# Altium schematic sheet user.SchDoc
size 381 x 215 mm; PageSetup: Record=PageOptions|CenterHorizontal=True|CenterVertical=True|PrintScale=0.77|XCorrection=1.00|YCorrection=1.00|PrintKind=0|BorderSize=5000000|LeftOffset=0|BottomOffset=0|Orientation=2|PaperLength=1000|PaperWidth=1000|Scale=100|PaperSource=7|PrintQuality=-3|MediaType=1|DitherType=10|PrintScaleMode=1|PaperKind=A4|PaperIndex=9
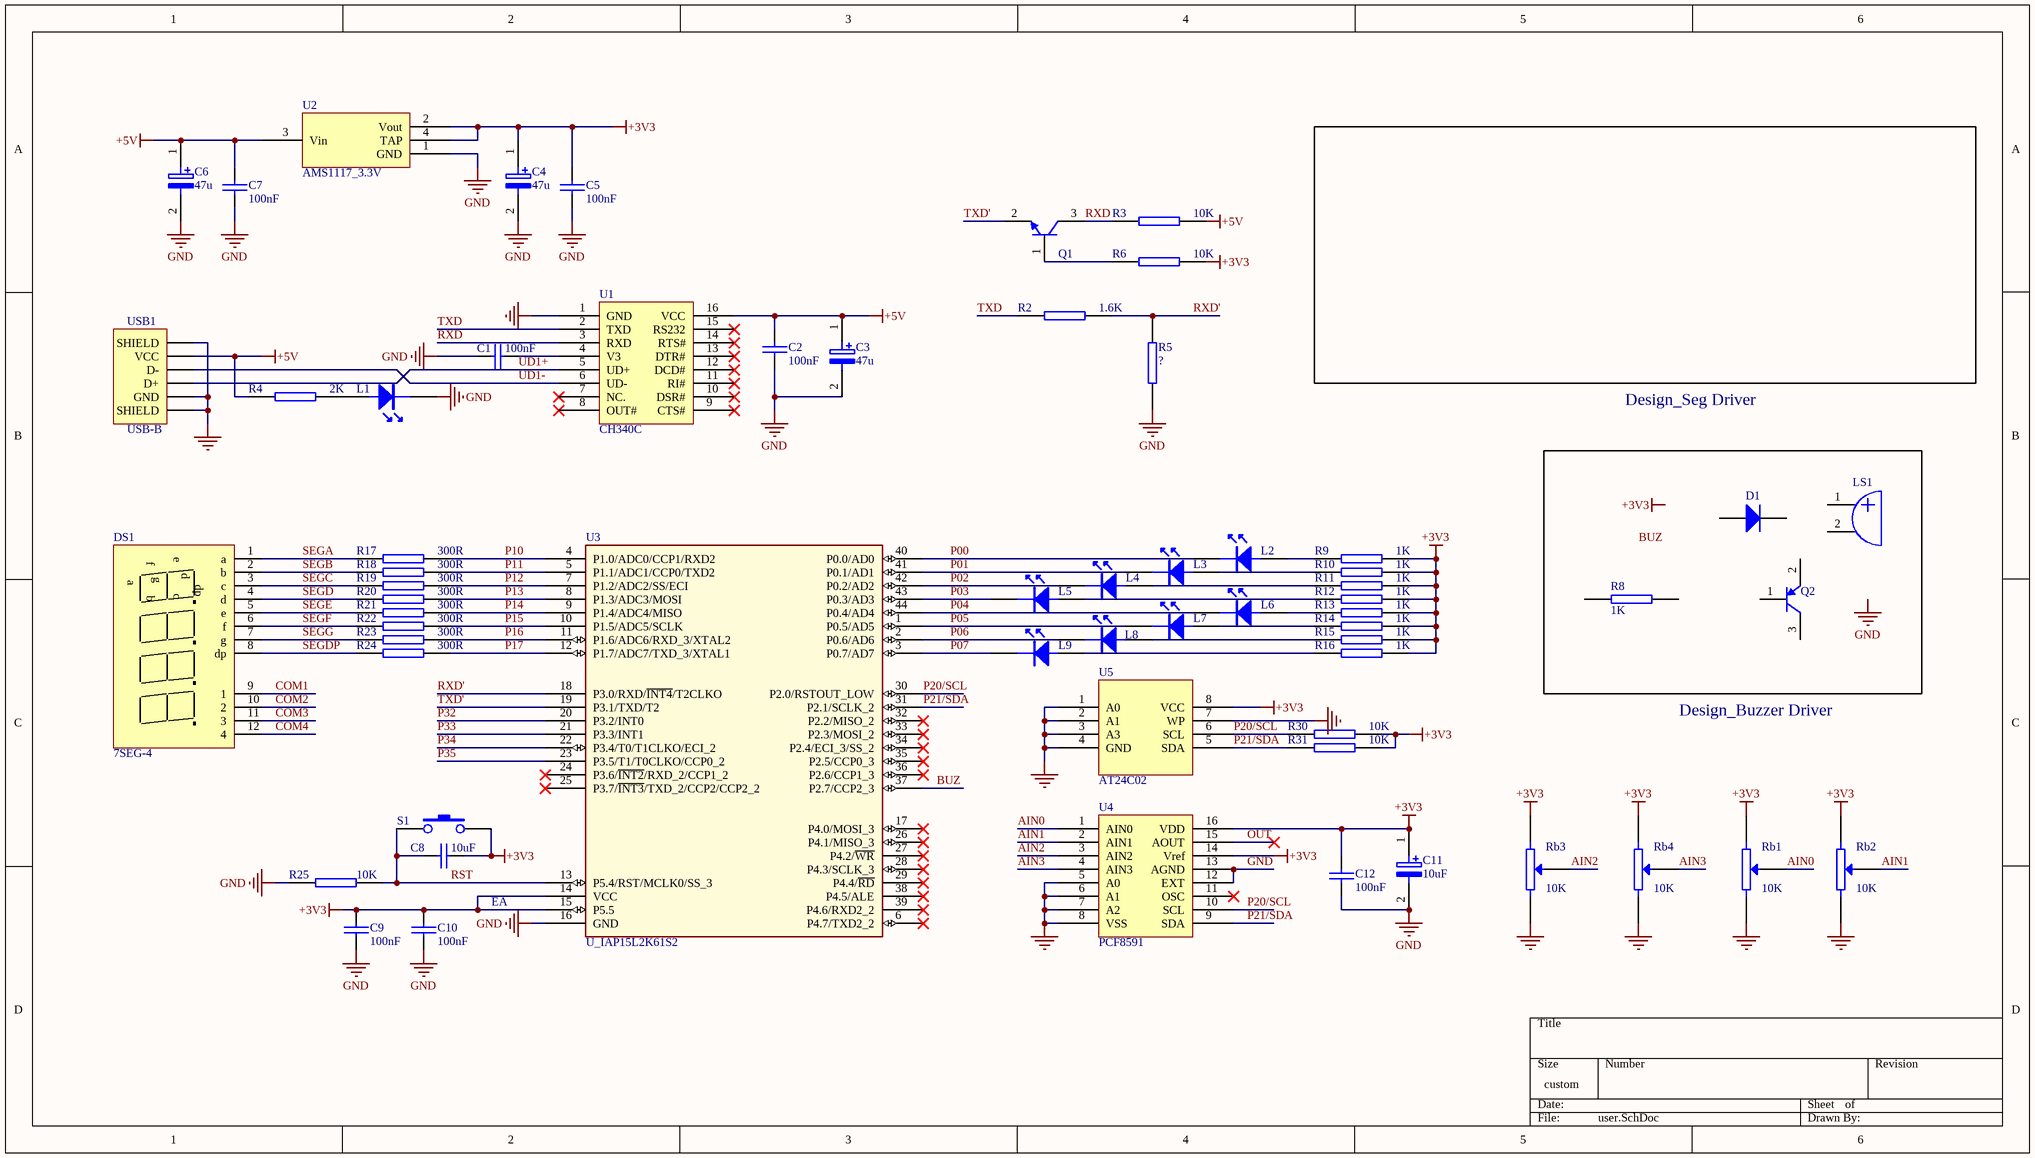
[diagram p0: user.SchDoc]

## Parts
C1  100nF
C2  100nF
C3  47u
C4  47u
C5  100nF
C6  47u
C7  100nF
C8  10uF
C9  100nF
C10  100nF
C11  10uF
C12  100nF
D1  (no value)
DS1  7SEG-4
L1  LED  (value not drawn)
L2  LED  (value not drawn)
L3  LED  (value not drawn)
L4  LED  (value not drawn)
L5  LED  (value not drawn)
L6  LED  (value not drawn)
L7  LED  (value not drawn)
L8  LED  (value not drawn)
L9  LED  (value not drawn)
LS1  S_BUZZER  (value not drawn)
Q1  8050-SOT23  (value not drawn)
Q2  (no value)
R2  1.6K
R3  10K
R4  2K
R5  ?
R6  10K
R8  1K
R9  1K
R10  1K
R11  1K
R12  1K
R13  1K
R14  1K
R15  1K
R16  1K
R17  300R
R18  300R
R19  300R
R20  300R
R21  300R
R22  300R
R23  300R
R24  300R
R25  10K
R30  10K
R31  10K
Rb1  10K
Rb2  10K
Rb3  10K
Rb4  10K
S1  SW-PB  (value not drawn)
U1  CH340C
U2  AMS1117_3.3V
U3  U_IAP15L2K61S2
U4  PCF8591
U5  AT24C02
USB1  USB-B

## Nets
+3V3: C4.1 C5.2 C8.2 C9.1 C10.1 C11.1 C12.2 R6.1 R9.2 R10.2 R11.2 R12.2 R13.2 R14.2 R15.2 R16.2 R30.1 R31.1 Rb1.1 Rb2.1 Rb3.1 Rb4.1 S1.2 U2.2(Vout) U2.4(TAP) U3.14(VCC) U3.15(P5.5) U4.14(Vref) U4.16(VDD) U5.8(VCC)
+5V: C2.1 C3.1 C6.1 C7.2 R3.1 R4.2 U1.16(VCC) U2.3(Vin) USB1.1(VCC)
GND: C1.1 C2.2 C3.2 C4.2 C5.1 C6.2 C7.1 C9.2 C10.2 C11.2 C12.1 L1.2(K) R5.2 R25.2 Rb1.3 Rb2.3 Rb3.3 Rb4.3 U1.1(GND) U2.1(GND) U3.16(GND) U4.5(A0) U4.6(A1) U4.7(A2) U4.8(VSS) U4.12(EXT) U4.13(AGND) U5.1(A0) U5.2(A1) U5.3(A3) U5.4(GND) U5.7(WP) USB1.4(GND) USB1.5(SHIELD) USB1.6(SHIELD)
AIN0: Rb1.2(W) U4.1(AIN0)
AIN1: Rb2.2(W) U4.2(AIN1)
AIN2: Rb3.2(W) U4.3(AIN2)
AIN3: Rb4.2(W) U4.4(AIN3)
BUZ: U3.37(P2.7/CCP2_3)
COM1: DS1.9(1)
COM2: DS1.10(2)
COM3: DS1.11(3)
COM4: DS1.12(4)
OUT: U4.15(AOUT)
P00: L2.2(K) U3.40(P0.0/AD0)
P01: L3.2(K) U3.41(P0.1/AD1)
P02: L4.2(K) U3.42(P0.2/AD2)
P03: L5.2(K) U3.43(P0.3/AD3)
P04: L6.2(K) U3.44(P0.4/AD4)
P05: L7.2(K) U3.1(P0.5/AD5)
P06: L8.2(K) U3.2(P0.6/AD6)
P07: L9.2(K) U3.3(P0.7/AD7)
P10: R17.2 U3.4(P1.0/ADC0/CCP1/RXD2)
P11: R18.2 U3.5(P1.1/ADC1/CCP0/TXD2)
P12: R19.2 U3.7(P1.2/ADC2/SS/ECI)
P13: R20.2 U3.8(P1.3/ADC3/MOSI)
P14: R21.2 U3.9(P1.4/ADC4/MISO)
P15: R22.2 U3.10(P1.5/ADC5/SCLK)
P16: R23.2 U3.11(P1.6/ADC6/RXD_3/XTAL2)
P17: R24.2 U3.12(P1.7/ADC7/TXD_3/XTAL1)
P20/SCL: R30.2 U3.30(P2.0/RSTOUT_LOW) U4.10(SCL) U5.6(SCL)
P21/SDA: R31.2 U3.31(P2.1/SCLK_2) U4.9(SDA) U5.5(SDA)
P32: U3.20(P3.2/INT0)
P33: U3.21(P3.3/INT1)
P34: U3.22(P3.4/T0/T1CLKO/ECI_2)
P35: U3.23(P3.5/T1/T0CLKO/CCP0_2)
RST: C8.1 R25.1 S1.1 U3.13(P5.4/RST/MCLK0/SS_3)
RXD: Q1.3(C) R3.2 U1.3(RXD)
RXD': R2.1 R5.1 U3.18(P3.0/RXD/~{INT4}/T2CLKO)
SEGA: DS1.1(a) R17.1
SEGB: DS1.2(b) R18.1
SEGC: DS1.3(c) R19.1
SEGD: DS1.4(d) R20.1
SEGDP: DS1.8(dp) R24.1
SEGE: DS1.5(e) R21.1
SEGF: DS1.6(f) R22.1
SEGG: DS1.7(g) R23.1
TXD: R2.2 U1.2(TXD)
TXD': Q1.2(E) U3.19(P3.1/TXD/T2)
UD1+: U1.5(UD+) USB1.3(D+)
UD1-: U1.6(UD-) USB1.2(D-)
NetC1_2: C1.2 U1.4(V3)
NetL1_1: L1.1(A) R4.1
NetL2_1: L2.1(A) R9.1
NetL3_1: L3.1(A) R10.1
NetL4_1: L4.1(A) R11.1
NetL5_1: L5.1(A) R12.1
NetL6_1: L6.1(A) R13.1
NetL7_1: L7.1(A) R14.1
NetL8_1: L8.1(A) R15.1
NetL9_1: L9.1(A) R16.1
NetQ1_1: Q1.1(B) R6.2

Not connected (* = marked no-connect by the designer): D1 1(A) 2(K); LS1 1 2; Q2 1(B) 2(E) 3(C); R8 1 2; U1 7(NC.)* 8(OUT#)* 9(CTS#)* 10(DSR#)* 11(RI#)* 12(DCD#)* 13(DTR#)* 14(RTS#)* 15(RS232)*; U3 6(P4.7/TXD2_2)* 17(P4.0/MOSI_3)* 24(P3.6/~{INT2}/RXD_2/CCP1_2)* 25(P3.7/~{INT3}/TXD_2/CCP2/CCP2_2)* 26(P4.1/MISO_3)* 27(P4.2/~{WR})* 28(P4.3/SCLK_3)* 29(P4.4/~{RD})* 32(P2.2/MISO_2)* 33(P2.3/MOSI_2)* 34(P2.4/ECI_3/SS_2)* 35(P2.5/CCP0_3)* 36(P2.6/CCP1_3)* 38(P4.5/ALE)* 39(P4.6/RXD2_2)*; U4 11(OSC)*

## Notes on the sheet
- Design_Seg Driver
- Design_Buzzer Driver
- EA
- Labels drawn without touching a wire or pin: +3V3, BUZ, GND

## Library data of the parts
C1 C2 C8-C10 = CAP
C3 C4 C6 = CAP-2: Electrolytic Capacitor
C5 C7 = C_CAP: Capacitor; 中文名称: 贴片电容
C11 = ELECTRO2: Electrolytic Capacitor
C12 = CAP: Capacitor
D1 = Diode 1N914: High Conductance Fast Diode
DS1 = 7SEG-4: 4 Seven-Segment Display, Right Hand Decimal
Q1 = Q_NPN: PNP-S8050; 中文名称: 三极管
Q2 = 2N3906: PNP General Purpose Amplifier
R2-R6 R8-R25 R30 R31 = RES2
Rb1-Rb4 = POT2: Potentiometer
U2 = U_ASM1117: POWER; 中文名称: 稳压芯片
U3 = U_IAP15F2K61S2: MCU; 中文名称: STC15系列单片机
USB1 = USB_A: Connector